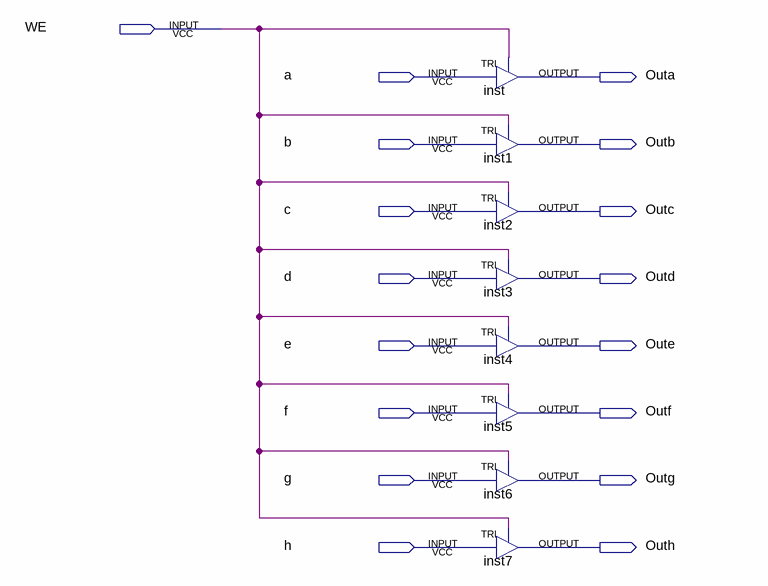
[diagram p0: schematic sheet]
// Quartus schematic Tri8.bdf as structural Verilog: 8 symbols, 17 pins
module Tri8 (
  input  WE,
  input  a,
  input  b,
  input  c,
  input  d,
  input  e,
  input  f,
  input  g,
  input  h,
  output Outa,
  output Outb,
  output Outc,
  output Outd,
  output Oute,
  output Outf,
  output Outg,
  output Outh
);

  TRI inst (.IN(a), .OE(WE), .OUT(Outa));
  TRI inst1 (.IN(b), .OE(WE), .OUT(Outb));
  TRI inst2 (.IN(c), .OE(WE), .OUT(Outc));
  TRI inst3 (.IN(d), .OE(WE), .OUT(Outd));
  TRI inst4 (.IN(e), .OE(WE), .OUT(Oute));
  TRI inst5 (.IN(f), .OE(WE), .OUT(Outf));
  TRI inst6 (.IN(g), .OE(WE), .OUT(Outg));
  TRI inst7 (.IN(h), .OE(WE), .OUT(Outh));
endmodule
